# EAGLE design 74 (EAGLE 6.5.0)
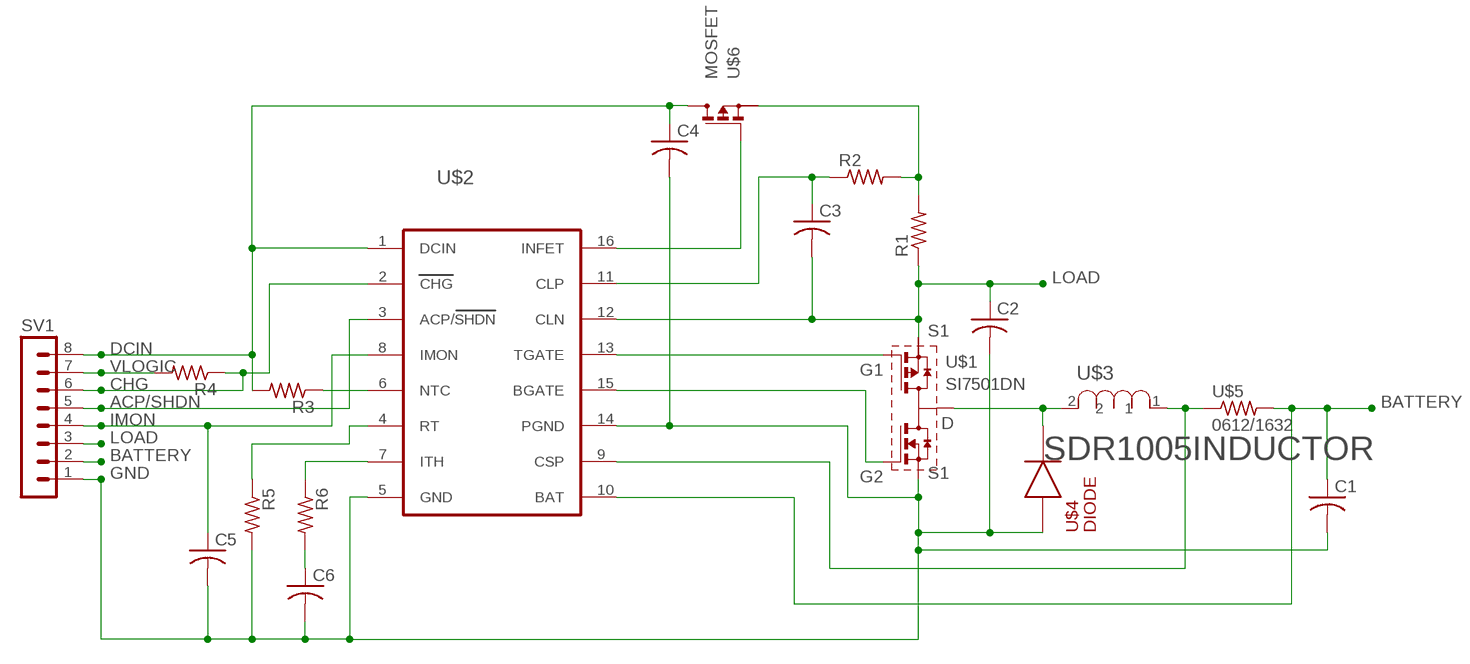
[diagram p0: schematic, sheet 1]

## Parts
C1  C-USC1210  [C1210]
C2  C-USC1210  [C1210]
C3  C-USC1210  [C1210]
C4  C-USC1210  [C1210]
C5  C-USC1210  [C1210]
C6  C-USC1210  [C1210]
R1  R-US_R1206  [R1206]
R2  R-US_R1206  [R1206]
R3  R-US_R1206  [R1206]
R4  R-US_R1206  [R1206]
R5  R-US_R1206  [R1206]
R6  R-US_R1206  [R1206]
SV1  MA08-1  [MA08-1]
U$1  SI7501DN  [POWERPAK]
U$2  LTC6004  [SSOP-16]
U$3  SDR1005INDUCTOR  [POWERINDUCTOR]
U$4  DIODE  [DIODE]
U$5  0612/1632  [0612/1632]
U$6  MOSFET  [SOT-23]

## Nets
ACP/SHDN: SV1.5 U$2.3(ACP/SHDN)
BATTERY: C1.1 SV1.2 U$2.10(BAT) U$5.2
CHG: R4.1 SV1.6 U$2.2(CHG)
DCIN: C4.1 R3.2 SV1.8 U$2.1(DCIN) U$6.DRAIN(D)
GND: C1.2 C2.2 C4.2 C5.2 C6.2 R5.2 SV1.1 U$1.S2 U$2.5(GND) U$2.14(PGND) U$4.P$1
IMON: C5.1 SV1.4 U$2.8(IMON)
LOAD: C2.1 C3.2 R1.1 SV1.3 U$1.S1 U$2.12(CLN)
N$1: U$1.G1 U$2.13(TGATE)
N$2: U$1.G2 U$2.15(BGATE)
N$3: U$1.D U$3.2 U$4.P$2
N$4: U$2.9(CSP) U$3.1 U$5.1
N$6: C3.1 R2.1 U$2.11(CLP)
N$7: R1.2 R2.2 U$6.SOURCE(S)
N$8: U$2.16(INFET) U$6.GATE(G)
N$9: R6.1 U$2.7(ITH)
N$10: R3.1 U$2.6(NTC)
N$11: C6.1 R6.2
N$12: R5.1 U$2.4(RT)
VLOGIC: R4.2 SV1.7

## Library data of the parts
C1-C6 = resistor:C-US: CAPACITOR, American symbol
R1-R6 = resistor:R-US_: RESISTOR, American symbol
SV1 = con-lstb:MA08-1: PIN HEADER; OC_FARNELL: unknown; OC_NEWARK: unknown
U$1 = Custom:SI7501DN
U$2 = Custom:LTC6004
U$3 = Custom:SDR1005INDUCTOR
U$4 = Custom:DIODE
U$5 = Custom:0612/1632
U$6 = Custom:MOSFET

## Board
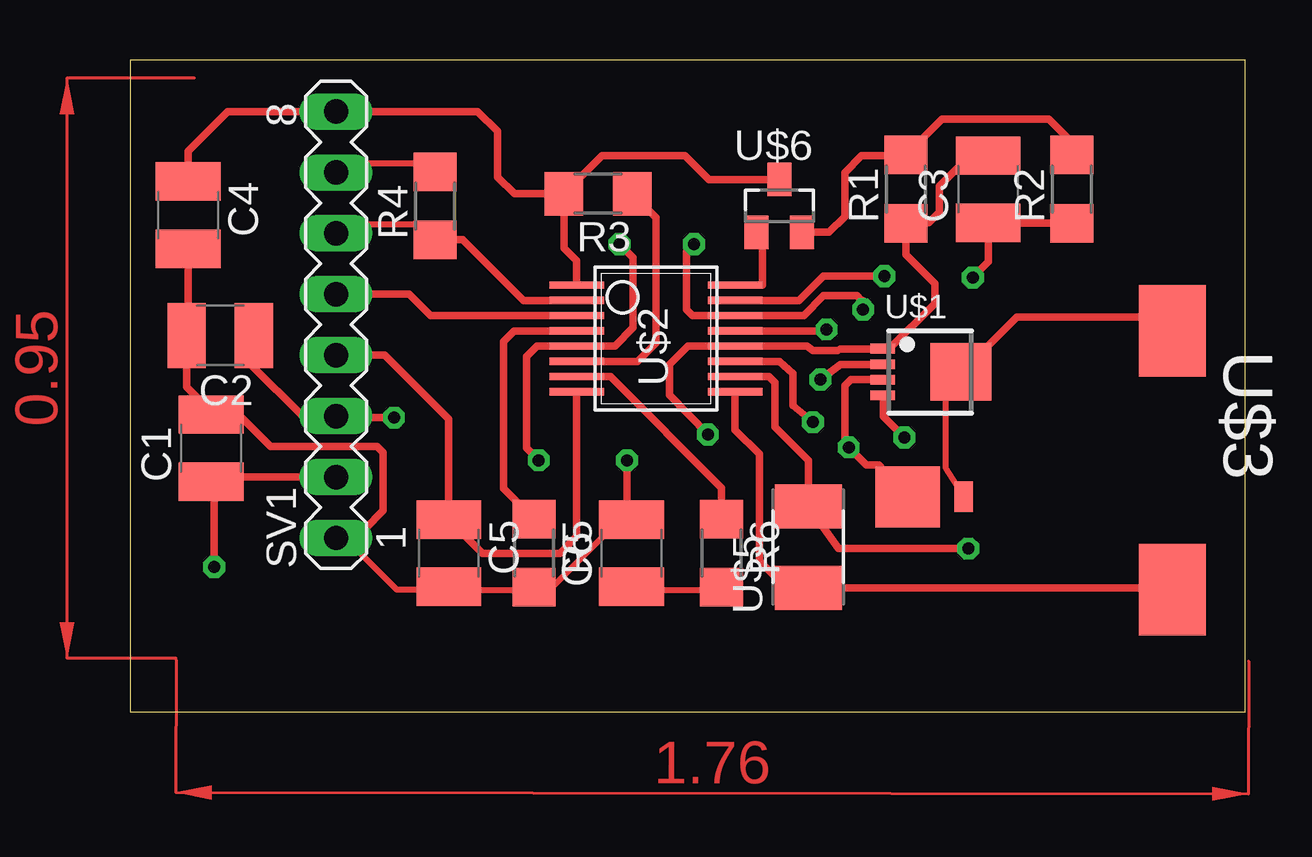
[diagram p1: board, top side]
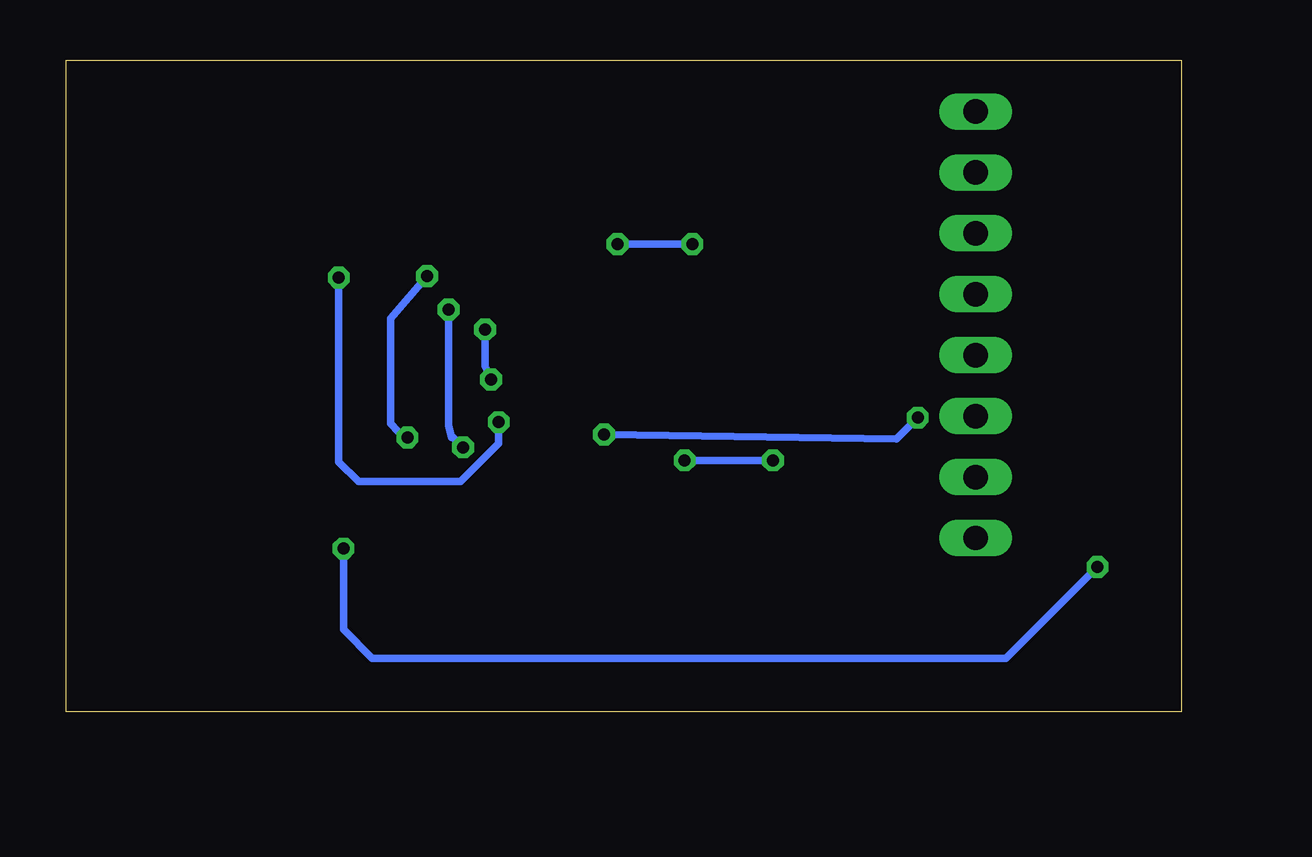
[diagram p2: board, bottom side, seen from below]

Size 46.47 x 27.17 mm. Coordinates in mm from the lower left corner, seen from the top.
Outline: 0,0 46.47,0 46.47,27.17 0,27.17 0,0
Copper layers (1*16): Top 0.035mm / dielectric 1.5mm / Bottom 0.035mm
Design rules "default": minimum track width 10mil, minimum drill 24mil, track to track 8mil, track to pad 8mil, pad to pad 8mil, via to via 8mil, smd to smd 8mil, copper to edge 40mil, drill to drill 8mil, minimum pad ring 10mil, minimum via ring 8mil, stop-mask expansion 4mil, vias tented up to drill 0mil, thermal gap 10mil

### Footprints (pad centres in the part's own frame; a part is rotated, then mirrored left to right if it is on the bottom)
C1210 = smd 1.6 x 2.7: 1 -1.4,0; 2 1.4,0
R1206 = smd 1.6 x 1.803: 1 -1.422,0; 2 1.422,0
MA08-1 = drill 1.016 long: 1 -8.89,0; 2 -6.35,0; 3 -3.81,0; 4 -1.27,0; 5 1.27,0; 6 3.81,0; 7 6.35,0; 8 8.89,0
POWERPAK = smd 2.4 x 2.54: D 0,1.27 | smd 0.4 x 1.016: G1 -0.325,-1.976; G2 0.975,-1.976; S1 -0.975,-1.976; S2 0.325,-1.976
SSOP-16 = smd 2.286 x 0.305: 1 -3.302,2.349; 2 -3.302,1.714; 3 -3.302,1.079; 4 -3.302,0.444; 5 -3.302,-0.191; 6 -3.302,-0.826; 7 -3.302,-1.461; 8 -3.302,-2.096; 9 3.302,-2.096; 10 3.302,-1.461; 11 3.302,-0.826; 12 3.302,-0.191; 13 3.302,0.444; 14 3.302,1.079; 15 3.302,1.714; 16 3.302,2.349
POWERINDUCTOR = smd 3.81 x 2.794: 1 5.397,0; 2 -5.397,0
DIODE = smd 2.667 x 2.54: P$1 -1.638,0 | smd 0.762 x 1.27: P$2 0.699,0
0612/1632 = smd 1.84 x 2.8: 1 -1.7,0; 2 1.7,0
SOT-23 = smd 1 x 1.4: DRAIN 0,1.1; GATE -0.95,-1.1; SOURCE 0.95,-1.1

### Placement (x,y rotation side)
C1  3.37,10.99 90 top
C2  3.75,15.68 180 top
C3  35.75,21.78 90 top
C4  2.41,20.7 270 top
C5  13.27,6.6 270 top
C6  20.89,6.6 90 top
R1  32.32,21.78 90 top
R2  39.24,21.78 90 top
R3  19.49,21.59 180 top
R4  12.7,21.08 90 top
R5  16.83,6.6 270 top
R6  24.64,6.6 270 top
SV1  8.57,16.13 90 top
U$1  33.34,14.16 270 top
U$2  21.91,15.43 0 top
U$3  43.43,10.48 270 top
U$4  34.04,8.95 0 top
U$5  28.26,6.86 90 top
U$6  27.05,21.08 0 top

### Tracks (layer width: path | path; a pad name or v marks a point on that pad's centre or on a via)
ACP/SHDN
  Top 0.305: U$2.3 12.51,16.51 11.62,17.4 SV1.5
BATTERY  (via drill 0.5 pad 0.25)
  Top 0.254: 3.49,10.16 C1.1
  Top 0.305: U$2.10 26.61,13.97 26.86,13.72 26.86,11.87 28.26,10.48 U$5.2 29.51,6.79 v34.92,6.79 | SV1.2 3.56,9.78 C1.1 | 3.49,10.16 v3.49,6.03
  Bottom 0.305: v34.92,6.79 34.92,3.43 33.72,2.22 7.3,2.22 v3.49,6.03
CHG
  Top 0.254: R4.1 12.38,20.32 8.57,20.32 SV1.6
  Top 0.305: U$2.2 16.38,17.14 13.84,19.68 12.73,19.68 R4.1
DCIN
  Top 0.254: 18.73,17.78 U$2.1
  Top 0.305: R3.2 18.07,19.33 18.61,18.8 U$2.1 | U$6.DRAIN 24.11,22.18 23.11,23.18 19.66,23.18 R3.2 | R3.2 16,21.59 15.3,22.29 15.3,24.19 14.48,25.02 SV1.8 4.06,25.02 2.41,23.37 C4.1
GND  (via drill 0.5 pad 0.25)
  Top 0.254: 3.49,12.7 C1.2 | SV1.1 8.57,7.62 11.11,5.08 12.38,5.08 C5.2 13.65,5.08 16.19,5.08 R5.2 17.46,5.08 20,7.62 C6.2 21.27,7.62 | 32.7,8.89 U$4.P$1
  Top 0.305: v17.02,10.48 16.51,10.99 16.51,14.8 16.95,15.24 U$2.5 20.19,15.24 20.96,16 20.96,18.92 v20.38,19.49 | 21.27,7.62 20.7,8.19 v20.7,10.48 | U$1.S2 30.03,13.84 29.78,13.59 29.78,11.18 v29.94,11.02 30.67,10.29 31.19,10.29 U$4.P$1 | 8.57,7.62 9.78,7.62 10.54,8.38 10.54,10.79 10.29,11.05 5.84,11.05 4.51,12.38 C1.2 | v23.5,19.49 23.18,19.18 23.18,16.76 23.43,16.51 U$2.14 28.07,16.51 28.89,17.34 30.29,17.34 30.48,17.14 30.54,17.14 v30.54,16.76 | 3.49,12.7 3.18,12.7 2.35,13.53 C2.2 2.41,15.75 C4.2
  Bottom 0.305: v17.02,10.48 v20.7,10.48 | v20.38,19.49 v23.5,19.49 | v30.54,16.76 30.54,11.94 30.42,11.43 30.35,11.43 v29.94,11.02
IMON
  Top 0.254: 12.38,7.62 C5.1 | 8.57,15.24 SV1.4
  Top 0.305: U$2.8 18.61,7.3 17.91,6.6 14.67,6.6 C5.1 13.27,12.19 10.6,14.86 SV1.4
LOAD  (via drill 0.5 pad 0.25)
  Top 0.305: v24.07,11.56 22.48,13.21 22.48,14.48 23.24,15.24 U$2.12 28.19,15.24 28.45,15.05 29.46,15.05 29.59,15.11 31.34,15.11 U$1.S1 31.65,15.14 33.53,17.02 33.53,17.84 32.32,19.05 R1.1 32.35,20.38 33.27,20.38 33.72,20.83 33.72,21.91 34.99,23.18 C3.2 | v10.99,12.26 8.64,12.26 SV1.3 7.18,12.32 5.02,14.48 5.02,15.55 C2.1
  Bottom 0.305: v24.07,11.56 11.87,11.37 v10.99,12.26
N$1  (via drill 0.5 pad 0.25)
  Top 0.305: U$2.13 29.02,15.87 v29.02,15.94 | v28.77,13.84 29.59,14.48 31.29,14.48 U$1.G1
  Bottom 0.305: v29.02,15.94 29.02,14.41 v28.77,13.84
N$2  (via drill 0.5 pad 0.25)
  Top 0.305: U$1.G2 31.38,13.21 31.38,12.3 v32.26,11.43 | U$2.15 27.88,17.14 28.89,18.16 v31.43,18.16
  Bottom 0.305: v32.26,11.43 32.64,11.68 32.96,12 32.96,16.38 v31.43,18.16
N$3
  Top 0.254: U$4.P$2 33.97,10.16 33.97,13.97 U$1.D 35.24,13.97
  Top 0.305: 35.24,13.97 35.24,14.73 36.96,16.45 42.86,16.45 arc-90 U$3.2
N$4
  Top 0.305: U$2.9 25.21,11.75 26.23,10.73 26.23,6.29 27.35,5.16 U$5.1 43.36,5.16 arc-90 U$3.1
N$6  (via drill 0.5 pad 0.25)
  Top 0.305: U$2.11 27.05,14.6 27.62,14.1 27.62,12.76 v28.45,12.06 | R2.1 35.77,20.36 | 35.77,20.36 C3.1 | 35.77,20.36 35.77,18.75 v35.12,18.1
  Bottom 0.305: v35.12,18.1 35.12,10.41 34.29,9.59 30.04,9.59 28.45,11.18 v28.45,12.06
N$7
  Top 0.305: U$6.SOURCE 29.13,19.98 29.78,20.64 29.78,22.48 30.48,23.18 32.3,23.18 R1.2 33.82,24.7 38.29,24.7 39.24,23.75 R2.2
N$8
  Top 0.254: 26.35,17.78 25.08,17.78 U$2.16
  Top 0.305: 26.35,17.78 26.35,19.73 U$6.GATE
N$9
  Top 0.305: U$2.7 20,13.97 24.64,9.34 R6.1
N$10
  Top 0.305: U$2.6 21.14,14.6 21.91,15.37 21.91,20.6 R3.1
N$11
  Top 0.254: R6.2 23.81,5.08 21.27,5.08 C6.1
N$12
  Top 0.305: U$2.4 16,15.87 15.56,15.43 15.56,9.3 R5.1
VLOGIC
  Top 0.254: R4.2 12.38,22.86 8.57,22.86 SV1.7
(copper drawn outside any net)
  shapes: Top area x2